# EAGLE design poti_encoder (EAGLE 9.6.2)
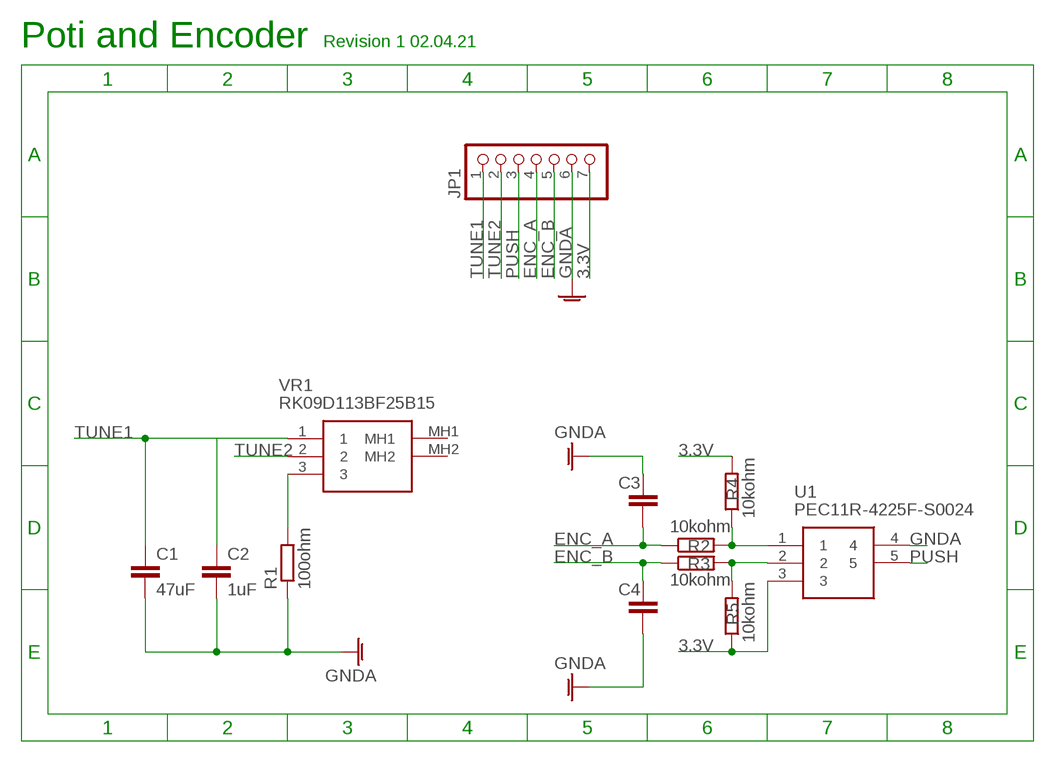
[diagram p0: schematic, sheet 1]

## Parts
C1  47uF  C-EU_1206C1206  [C1206]
C2  1uF  C-EU_805C0805  [C0805]
C3  C-EU_805C0805  [C0805]
C4  C-EU_805C0805  [C0805]
JP1  PINHD-1X7  [1X07]
R1  100ohm  R-EU_805R0805  [R0805]
R2  10kohm  R-EU_805R0805  [R0805]
R3  10kohm  R-EU_805R0805  [R0805]
R4  10kohm  R-EU_805R0805  [R0805]
R5  10kohm  R-EU_805R0805  [R0805]
U1  PEC11R-4225F-S0024  [PEC12R-4XXXF-SXXXX_1]
VR1  RK09D113BF25B15  [RK09D113BF25B15]

## Nets
3.3V: JP1.7 R4.2 R5.1 U1.3
ENC_A: C3.2 JP1.4 R2.1
ENC_B: C4.1 JP1.5 R3.1
GNDA: C1.2 C2.2 C3.1 C4.2 JP1.6 R1.1 U1.4
N$1: R2.2 R4.1 U1.1
N$2: R3.2 R5.2 U1.2
N$4: R1.2 VR1.3
PUSH: JP1.3 U1.5
TUNE1: C1.1 C2.1 JP1.1 VR1.1
TUNE2: JP1.2 VR1.2
Unconnected: VR1.MH1 VR1.MH2

## Notes on the sheet
- Poti and Encoder | Revision 1 02.04.21

## Library data of the parts
C1 = CommonParts:C-EU_1206: CAPACITOR, European symbol; SPICEPREFIX: C
C2-C4 = CommonParts:C-EU_805: CAPACITOR, European symbol; SPICEPREFIX: C
JP1 = pinhead:PINHD-1X7: PIN HEADER
R1-R5 = CommonParts:R-EU_805: RESISTOR, European symbol
U1 = MouserUseful:PEC11R-4225F-S0024: Incremental encoder 24 detents 24 pulses Source: Datasheet <https://componentsearchengine.com/Datasheets/1/PEC11R-4225F-S0024.pdf>; DESCRIPTION: Incremental encoder 24 detents 24 pulses; HEIGHT: mm; MANUFACTURER_NAME: Bourns; MANUFACTURER_PART_NUMBER: PEC11R-4225F-S0024; MOUSER_PART_NUMBER: 652-PEC11R-4225F-S24; MOUSER_PRICE-STOCK: https://www.mouser.co.uk/ProductDetail/Bourns/PEC11R-4225F-S0024?qs=Zq5ylnUbLm4N6UNkPX3pkQ%3D%3D
VR1 = MouserUseful:RK09D113BF25B15: Potentiometers V/ADJ 100K 25MM SHFT Source: Datasheet <https://componentsearchengine.com/Datasheets/1/RK09D113BF25B15.pdf>; DESCRIPTION: Potentiometers V/ADJ 100K 25MM SHFT; HEIGHT: 20mm; MANUFACTURER_NAME: ALPS; MANUFACTURER_PART_NUMBER: RK09D113BF25B15; MOUSER_PART_NUMBER: 688-RK09D113BF25B15; MOUSER_PRICE-STOCK: https://www.mouser.com/Search/Refine.aspx?Keyword=688-RK09D113BF25B15

## Board
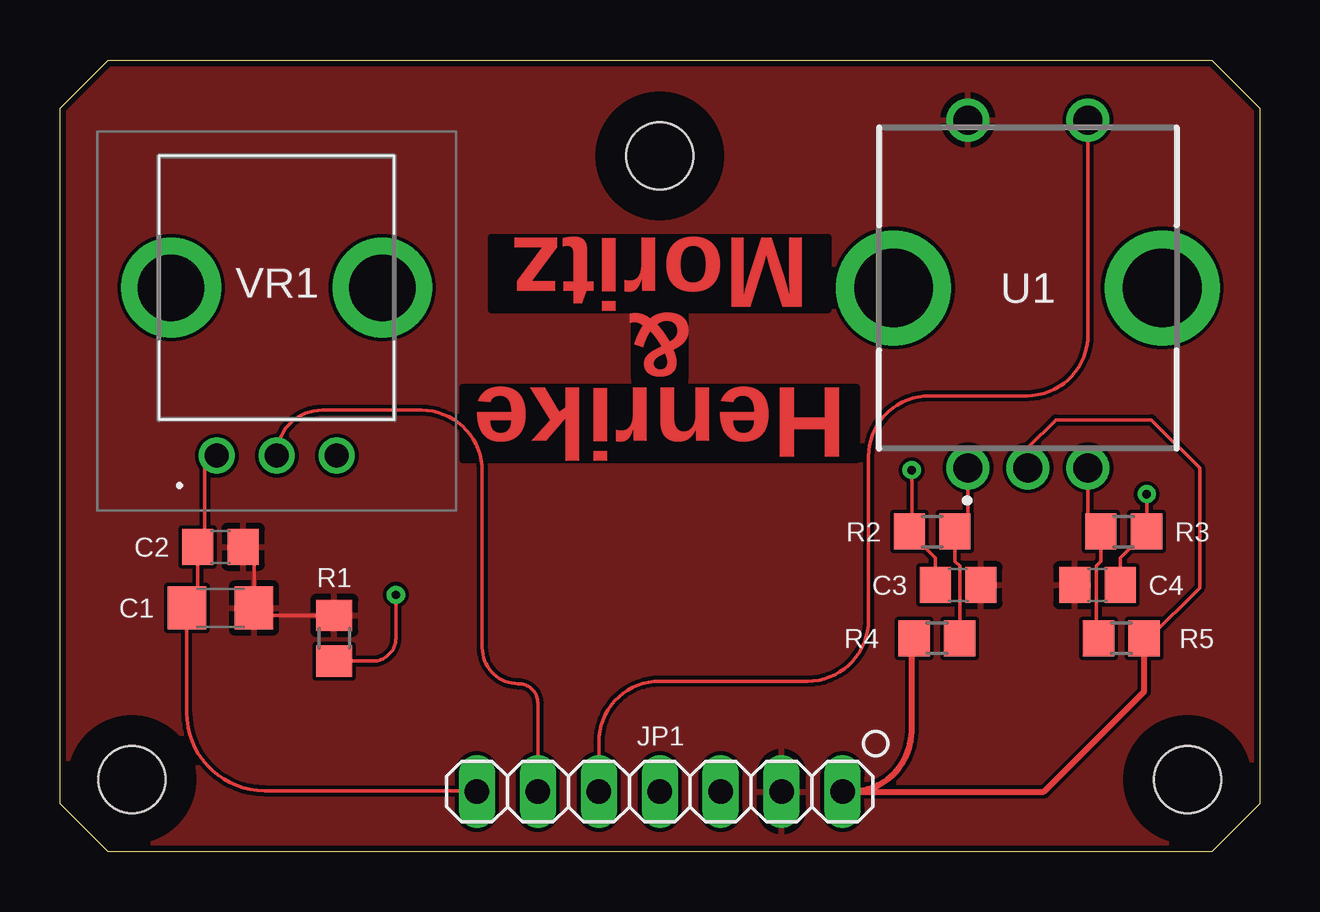
[diagram p1: board, top side]
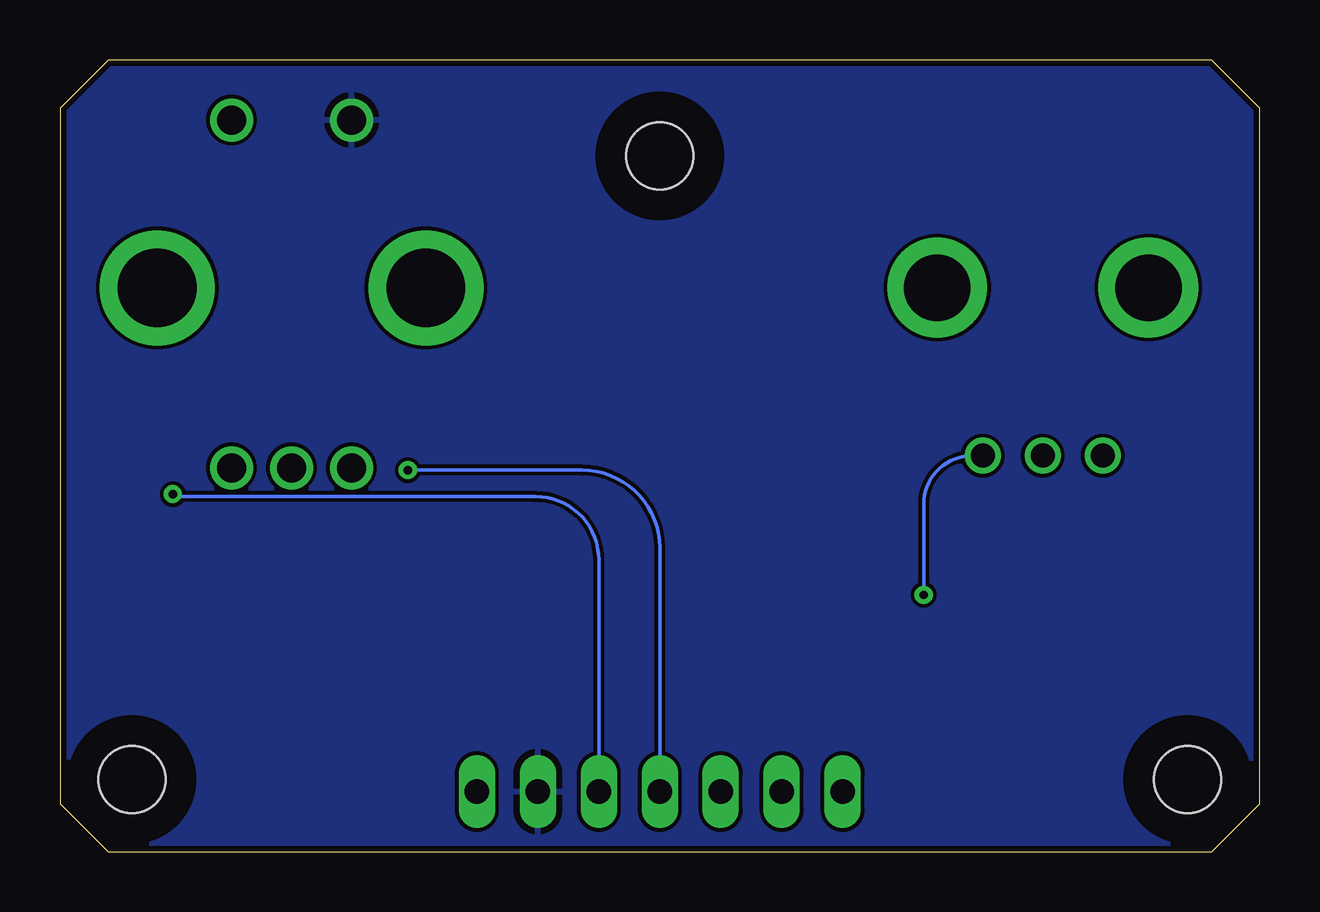
[diagram p2: board, bottom side, seen from below]

Size 50 x 33 mm. Coordinates in mm from the lower left corner, seen from the top.
Outline: 50,31 50,2 48,0 2,0 0,2 0,31 2,33 48,33 50,31
Copper layers (1*16): Top 0.035mm / dielectric 1.5mm / Bottom 0.035mm
Design rules "default *": minimum track width 6mil, minimum drill 0.35mm, track to track 6mil, track to pad 6mil, pad to pad 6mil, via to via 6mil, smd to smd 6mil, copper to edge 10mil, drill to drill 6mil, minimum pad ring 10mil, minimum via ring 8mil, stop-mask expansion 4mil, vias tented up to drill 0mil, thermal gap 10mil
Holes 2.8 mm at 25,29 47,3 3,3
tRestrict: area 23.6,27.6 to 26.4,30.4; area 45.6,1.6 to 48.4,4.4; area 1.6,1.6 to 4.4,4.4
bRestrict: area 45.6,1.6 to 48.4,4.4; area 1.6,1.6 to 4.4,4.4; area 23.6,27.6 to 26.4,30.4

### Footprints (pad centres in the part's own frame; a part is rotated, then mirrored left to right if it is on the bottom)
C1206 = smd 1.6 x 1.8: 1 -1.4,0; 2 1.4,0
C0805 = smd 1.3 x 1.5: 1 -0.95,0; 2 0.95,0
1X07 = drill 1.016 long: 1 -7.62,0; 2 -5.08,0; 3 -2.54,0; 4 0,0; 5 2.54,0; 6 5.08,0; 7 7.62,0
R0805 = smd 1.3 x 1.5: 1 -0.95,0; 2 0.95,0
PEC12R-4XXXF-SXXXX_1 = drill 1.2 pad 1.8: 1 -2.5,-7.5; 2 2.5,-7.5; 3 0,-7.5; 4 -2.5,7; 5 2.5,7 | drill 3.28 pad 4.8: 6 5.6,0; 7 -5.6,0
RK09D113BF25B15 = drill 1 pad 1.5: 1 0,0; 2 2.5,0; 3 5,0 | drill 2.77 pad 4.155: MH1 -1.9,7; MH2 6.9,7

### Placement (x,y rotation side)
C1  6.68,10.16 0 top
C2  6.68,12.7 0 top
C3  37.44,11.11 180 top
C4  43.25,11.11 180 top
JP1  25,2.5 0 top
R1  11.43,8.89 270 top
R2  36.35,13.34 0 top
R3  44.34,13.34 180 top
R4  36.55,8.89 180 top
R5  44.24,8.89 180 top
U1  40.34,23.5 0 top
VR1  6.53,16.51 0 top

### Tracks (layer width: path | path; a pad name or v marks a point on that pad's centre or on a via)
3.3V
  Top 0.152: U1.3 40.34,16.84 41.5,18 45.5,18 47.5,16 47.5,11 45.39,8.89 R5.1
  Top 0.254: R4.2 arc90 35.5,8.79 35.5,5.04 arc-90 32.96,2.5 JP1.7 41,2.5 45.19,6.69 R5.1
ENC_A  (via drill 0.35)
  Top 0.152: R2.1 35.52,13.22 | 35.52,13.22 36.49,12.25 C3.2 | v35.5,15.9 arc-90 35.52,15.88 35.52,13.22
  Bottom 0.152: JP1.4 25,12.66 arc-90 28.24,15.9 v35.5,15.9
ENC_B  (via drill 0.35)
  Top 0.152: 45.5,13.12 45.36,13.26 | 45.36,13.26 R3.1 44.2,12.25 C4.1 arc90 44.21,11.1 | v45.3,14.9 45.3,13.32 arc90 45.36,13.26
  Bottom 0.152: JP1.5 27.54,12.16 arc-90 30.18,14.8 45.3,14.8 v45.3,14.9
GNDA
  Top 0.152: C2.2 8.09,12.25 C1.2 8.4,9.84 R1.1 11.77,9.5
  pour Top: 0,33 50,33 50,0 0,0
  pour Bottom: 0,33 50,33 50,0 0,0
N$1
  Top 0.152: 36.99,13.02 arc-90 R2.2 | 37.84,13.88 arc-90 R2.2 | R2.2 37.3,12.1 37.5,11.9 R4.1 | U1.1 37.84,13.88 | 37.84,13.88 R2.2
N$2
  Top 0.152: 42.89,15.95 U1.2 42.84,13.84 43.39,13.3 | R3.2 43.39,13.3 | 43.39,13.3 43.39,12.09 43.2,11.9 43.2,8.98 R5.2
N$4  (via drill 0.35)
  Top 0.152: R1.2 13.04,7.94 arc90 14,8.9 v14,10.7
  Bottom 0.152: v14,10.7 14,14.47 arc90 11.96,16.51 VR1.3
PUSH
  Top 0.152: U1.5 42.84,21.54 arc-90 40.3,19 36.24,19 arc90 33.7,16.46 33.7,9.64 arc-90 31.16,7.1 25,7.1 arc90 22.46,4.56 JP1.3
TUNE1
  Top 0.152: VR1.1 6.03,16.01 6.03,13 arc-90 C2.1 5.74,10.61 arc-90 C1.1 5.29,5.78 arc90 8.53,2.54 17.34,2.54 arc-90 JP1.1
TUNE2
  Top 0.152: VR1.2 arc-90 10.92,18.4 15.06,18.4 arc-90 17.6,15.86 17.6,8.5 arc90 19.1,7 arc-90 19.92,6.18 JP1.2

### Text on the board
Top: Moritz | & | Henrike
tStop: Moritz | & | Henrike